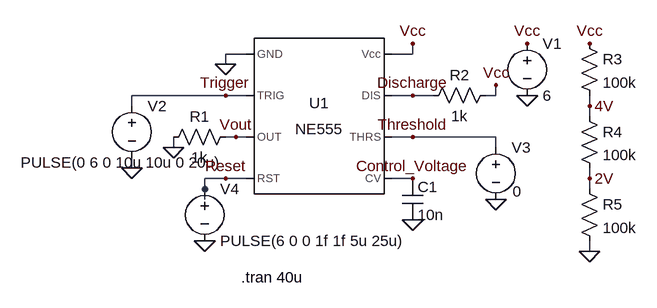
[diagram p0: schematic 555 Timer - I.asc]
555 Timer - I.asc, the LTspice schematic file:
Version 4
SHEET 1 880 680
WIRE 64 80 32 80
WIRE 320 80 320 64
WIRE 320 80 288 80
WIRE 32 96 32 80
WIRE 32 144 -112 144
WIRE 64 144 32 144
WIRE 320 144 288 144
WIRE 352 144 320 144
WIRE 448 144 448 128
WIRE 448 144 432 144
WIRE -112 160 -112 144
WIRE 592 160 592 144
WIRE 592 176 592 160
WIRE 48 208 32 208
WIRE 64 208 48 208
WIRE 320 208 288 208
WIRE 448 208 320 208
WIRE -48 224 -48 208
WIRE 448 224 448 208
WIRE -112 256 -112 240
WIRE 32 272 0 272
WIRE 64 272 32 272
WIRE 320 272 288 272
WIRE 592 272 592 256
WIRE 0 288 0 272
WIRE 592 288 592 272
WIRE 0 304 0 288
WIRE 592 384 592 368
FLAG 496 144 0
FLAG 496 64 Vcc
FLAG 320 64 Vcc
FLAG 32 96 0
FLAG -48 224 0
FLAG 320 336 0
FLAG 448 128 Vcc
FLAG -112 256 0
FLAG 0 368 0
FLAG 448 304 0
FLAG 32 144 Trigger
FLAG 48 208 Vout
FLAG 32 272 Reset
FLAG 320 272 Control_Voltage
FLAG 320 208 Threshold
FLAG 320 144 Discharge
FLAG 592 384 0
FLAG 592 64 Vcc
FLAG 592 272 2V
FLAG 592 160 4V
SYMBOL Misc\\NE555 176 176 R0
SYMATTR InstName U1
SYMBOL voltage 496 48 R0
WINDOW 123 0 0 Left 2
WINDOW 39 0 0 Left 2
SYMATTR InstName V1
SYMATTR Value 6
SYMBOL res 48 192 R90
WINDOW 0 0 56 VBottom 2
WINDOW 3 32 56 VTop 2
SYMATTR InstName R1
SYMATTR Value 1k
SYMBOL cap 304 272 R0
WINDOW 0 24 13 Left 2
SYMATTR InstName C1
SYMATTR Value 10n
SYMBOL res 448 128 R90
WINDOW 0 0 56 VBottom 2
WINDOW 3 32 56 VTop 2
SYMATTR InstName R2
SYMATTR Value 1k
SYMBOL voltage -112 144 R0
WINDOW 3 -171 103 Left 2
WINDOW 123 0 0 Left 2
WINDOW 39 0 0 Left 2
SYMATTR Value PULSE(0 6 0 10u 10u 0 20u)
SYMATTR InstName V2
SYMBOL voltage 0 272 R0
WINDOW 123 0 0 Left 2
WINDOW 39 0 0 Left 2
SYMATTR InstName V4
SYMATTR Value PULSE(6 0 0 1f 1f 5u 25u)
SYMBOL voltage 448 208 R0
WINDOW 3 26 84 Left 2
WINDOW 123 0 0 Left 2
WINDOW 39 0 0 Left 2
SYMATTR Value 0
SYMATTR InstName V3
SYMBOL res 576 48 R0
SYMATTR InstName R3
SYMATTR Value 100k
SYMBOL res 576 160 R0
SYMATTR InstName R4
SYMATTR Value 100k
SYMBOL res 576 272 R0
SYMATTR InstName R5
SYMATTR Value 100k
TEXT 56 424 Left 2 !.tran 40u

The netlist it stands for:
* 555 Timer - I.asc
XU1 0 Trigger Vout Reset Control_Voltage Threshold Discharge Vcc NE555  ; pins GND TRIG OUT RST CV THRS DIS Vcc
V1 Vcc 0 6
R1 Vout 0 1k
C1 Control_Voltage 0 10n
R2 Vcc Discharge 1k
V2 Trigger 0 PULSE(0 6 0 10u 10u 0 20u)
V4 Reset 0 PULSE(6 0 0 1f 1f 5u 25u)
V3 Threshold 0 0
R3 Vcc 4V 100k
R4 4V 2V 100k
R5 2V 0 100k
.tran 40u
.lib NE555.sub
.backanno
.end